# Altium schematic sheet AUDIO.SchDoc
size A4
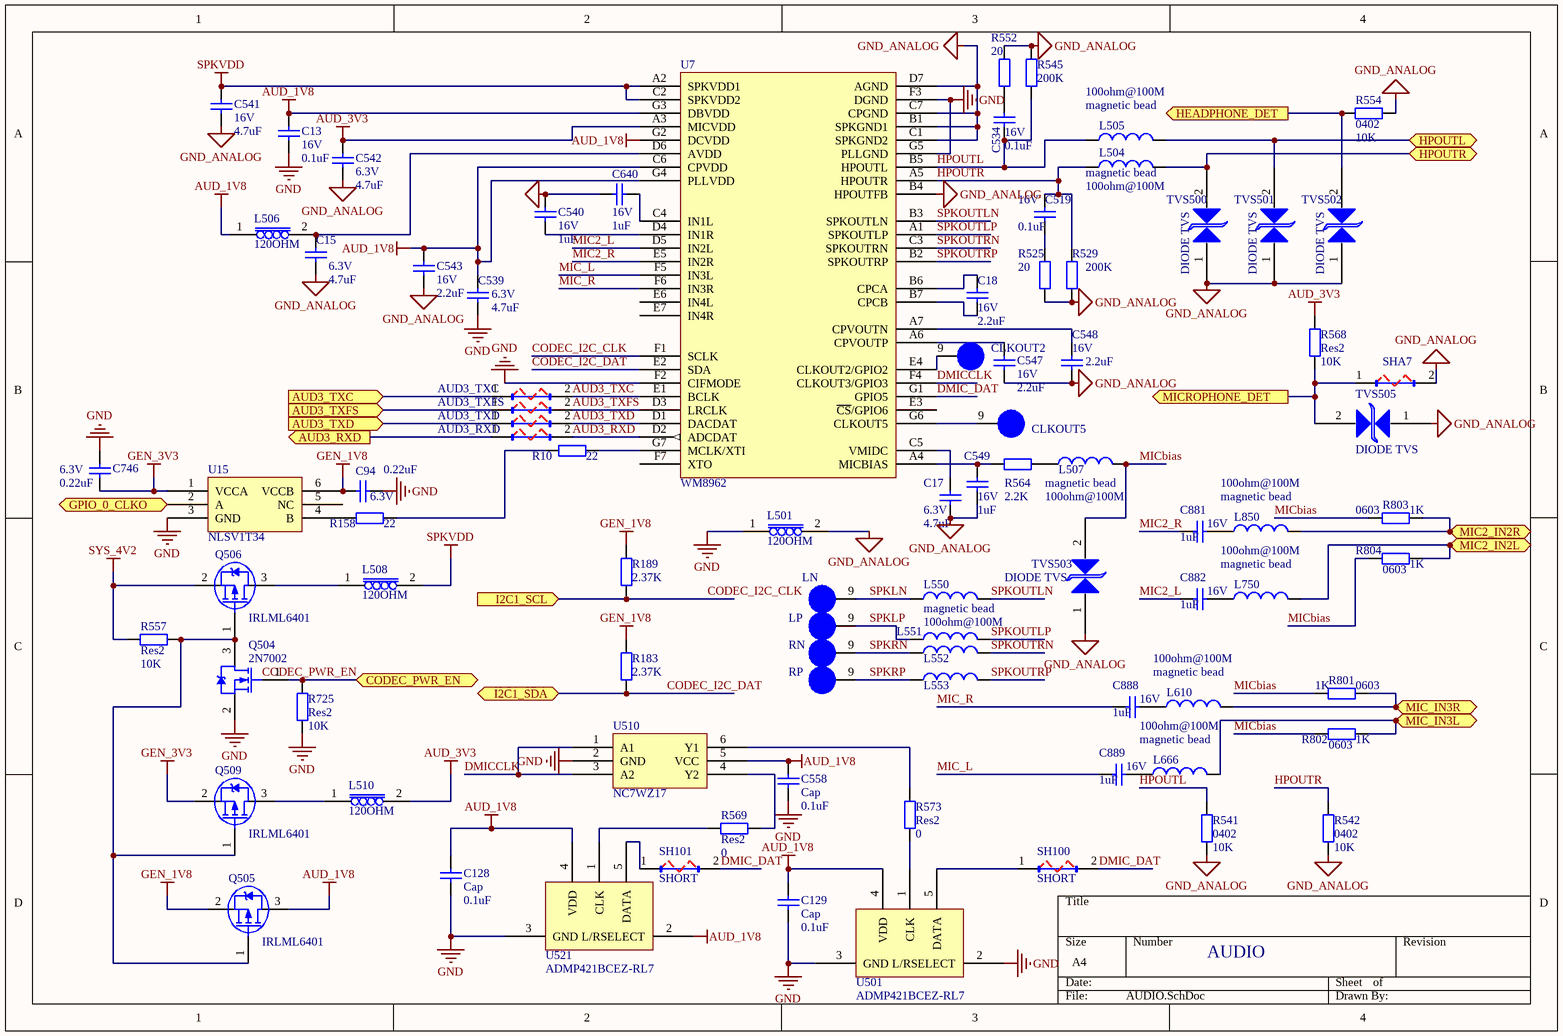
[diagram p0: AUDIO.SchDoc]

## Parts
AUD3_RXD  SHORT  [SHORT_SH]  (value not drawn)
AUD3_TXC  SHORT  [SHORT_SH]  (value not drawn)
AUD3_TXD  SHORT  [SHORT_SH]  (value not drawn)
AUD3_TXFS  SHORT  [SHORT_SH]  (value not drawn)
C13  16V  value 0.1uF  [0402]
C15  6.3V  value 4.7uF  [0603]
C17  6.3V  value 4.7uF  [0603]
C18  16V  value 2.2uF  [0603]
C94  6.3V  value 0.22uF  [0201]
C128  Cap  value 0.1uF  [0402]
C129  Cap  value 0.1uF  [0402]
C519  16V  value 0.1uF  [0402]
C534  16V  value 0.1uF  [0402]
C539  6.3V  value 4.7uF  [0603]
C540  16V  value 1uF  [0402]
C541  16V  value 4.7uF  [0603]
C542  6.3V  value 4.7uF  [0603]
C543  16V  value 2.2uF  [0603]
C547  16V  value 2.2uF  [0603]
C548  16V  value 2.2uF  [0603]
C549  16V  value 1uF  [0603]
C558  Cap  value 0.1uF  [0402]
C640  16V  value 1uF  [0402]
C746  6.3V  value 0.22uF  [0201]
C881  16V  value 1uF  [0603]
C882  16V  value 1uF  [0603]
C888  16V  value 1uF  [0603]
C889  16V  value 1uF  [0603]
CLKOUT2  TP test  [TP]  (value not drawn)
CLKOUT5  TP test  [TP]  (value not drawn)
L501  120OHM  [0603]
L504  magnetic bead  value 100ohm@100M  [0603]
L505  magnetic bead  value 100ohm@100M  [0603]
L506  120OHM  [0603]
L507  magnetic bead  value 100ohm@100M  [0603]
L508  120OHM  [0603]
L510  120OHM  [0603]
L550  magnetic bead  value 100ohm@100M  [0603]
L551  magnetic bead  [0603]  (value not drawn)
L552  magnetic bead  [0603]  (value not drawn)
L553  magnetic bead  [0603]  (value not drawn)
L610  magnetic bead  value 100ohm@100M  [0603]
L666  magnetic bead  value 100ohm@100M  [0603]
L750  magnetic bead  value 100ohm@100M  [0603]
L850  magnetic bead  value 100ohm@100M  [0603]
LN  TP test  [via]  (value not drawn)
LP  TP test  [via]  (value not drawn)
Q504  2N7002  [2N7002]
Q505  IRLML6401  [IRLML6401]
Q506  IRLML6401  [IRLML6401]
Q509  IRLML6401  [IRLML6401]
R10  22  [0603]
R158  22  [0402]
R183  value 2.37K  [0603]  (hidden comment: Res2)
R189  value 2.37K  [0603]  (hidden comment: Res2)
R525  value 20  [0603]  (hidden comment: Res2)
R529  value 200K  [0603]  (hidden comment: Res2)
R541  0402  value 10K  [0402]
R542  0402  value 10K  [0402]
R545  value 200K  [0603]  (hidden comment: Res2)
R552  value 20  [0603]  (hidden comment: Res2)
R554  0402  value 10K  [0402]
R557  Res2  value 10K  [0402]
R564  value 2.2K  [0603]  (hidden comment: Res2)
R568  Res2  value 10K  [0402]
R569  Res2  value 0  [0402]
R573  Res2  value 0  [0402]
R725  Res2  value 10K  [0402]
R801  0603  value 1K  [0603]
R802  0603  value 1K  [0603]
R803  0603  value 1K  [0603]
R804  0603  value 1K  [0603]
RN  TP test  [via]  (value not drawn)
RP  TP test  [via]  (value not drawn)
SH100  SHORT  [SHORT_SH]
SH101  SHORT  [SHORT_SH]
SHA7  SHORT  [SHORT_SH]  (value not drawn)
TVS500  DIODE TVS  [ESD9B3.3ST5G-SOD923]
TVS501  DIODE TVS  [ESD9B3.3ST5G-SOD923]
TVS502  DIODE TVS  [ESD9B3.3ST5G-SOD923]
TVS503  DIODE TVS  [ESD9B3.3ST5G-SOD923]
TVS505  DIODE TVS  [ESD9B3.3ST5G-SOD923]
U7  WM8962  [WM8962-BGA49]
U15  NLSV1T34  [NLSV1T34AM]
U501  ADMP421BCEZ-RL7  [ADMP421B-LGA_CAV]
U510  NC7WZ17  [NC7WZ17-SC70-6]
U521  ADMP421BCEZ-RL7  [ADMP421B-LGA_CAV]

## Ports
AUD3_RXD (out), AUD3_TXC (in), AUD3_TXD (in), AUD3_TXFS (in), CODEC_PWR_EN, GPIO_0_CLKO (bidir), HEADPHONE_DET (out), HPOUTL, HPOUTR, I2C1_SCL (in), I2C1_SDA (bidir), MIC2_IN2L, MIC2_IN2R, MIC_IN3L, MIC_IN3R, MICROPHONE_DET (out)

## Nets
AUD_1V8: C13.2 C128.2 C129.2 C539.2 C543.2 C558.1 L506.1(VSS3) Q505.3(D) U7.C6(CPVDD) U7.G2(DCVDD) U7.G3(DBVDD) U7.G4(PLLVDD) U501.4(VDD) U510.5(VCC) U521.2(L/RSELECT) U521.4(VDD)
AUD_3V3: C542.2 L510.2(VSS4) R568.2 U7.A3(MICVDD)
GEN_1V8: C94.1 Q505.2(S) R183.2 R189.2 U15.6(VCCB)
GEN_3V3: C746.2 Q509.2(S) U15.1(VCCA)
GND: C13.1 C94.2 C128.1 C129.1 C539.1 C558.2 C746.1 L501.1(VSS3) Q504.2(S) R725.1 U7.F2(CIFMODE) U7.F3(DGND) U7.G5(PLLGND) U15.3(GND) U501.2(L/RSELECT) U501.3(GND) U510.2(GND) U521.3(GND)
GND_ANALOG: C15.1 C17.1 C540.1 C541.1 C542.1 C543.1 C547.2 C548.2 C549.1 C640.1 L501.2(VSS4) R525.1 R529.1 R541.1 R542.1 R545.1 R552.1 R554.1 SHA7.2(VCCIO) TVS500.1(VSS6) TVS501.1(VSS6) TVS502.1(VSS6) TVS503.1(VSS6) TVS505.1(VSS6) U7.B1(SPKGND1) U7.B4(HPOUTFB) U7.C1(SPKGND2) U7.C7(CPGND) U7.D7(AGND)
SPKVDD: C541.2 L508.2(VSS4) U7.A2(SPKVDD1) U7.C2(SPKVDD2)
SYS_4V2: Q506.2(S) R557.1
AUD3_RXD: AUD3_RXD.2(VCCIO) U7.D2(ADCDAT)
AUD3_RXD: AUD3_RXD.1(VCCIO) ; port AUD3_RXD  [a separate net that carries the same name]
AUD3_TXC: AUD3_TXC.2(VCCIO) U7.E1(BCLK)
AUD3_TXC: AUD3_TXC.1(VCCIO) ; port AUD3_TXC  [a separate net that carries the same name]
AUD3_TXD: AUD3_TXD.2(VCCIO) U7.D1(DACDAT)
AUD3_TXD: AUD3_TXD.1(VCCIO) ; port AUD3_TXD  [a separate net that carries the same name]
AUD3_TXFS: AUD3_TXFS.2(VCCIO) U7.D3(LRCLK)
AUD3_TXFS: AUD3_TXFS.1(VCCIO) ; port AUD3_TXFS  [a separate net that carries the same name]
CODEC_I2C_CLK: R189.1 U7.F1(SCLK) ; port I2C1_SCL
CODEC_I2C_DAT: R183.1 U7.E2(SDA) ; port I2C1_SDA
CODEC_PWR_EN: Q504.1(G) R725.2 ; port CODEC_PWR_EN
DMIC_DAT: SH100.2(VCCIO) SH101.2(VCCIO) U7.G1(GPIO5)
DMICCLK: U7.F4(CLKOUT3/GPIO3) U510.1(A1) U510.3(A2)
GPIO_0_CLKO: U15.2(A) ; port GPIO_0_CLKO
HEADPHONE_DET: R554.2 TVS502.2(VSS5) ; port HEADPHONE_DET
HPOUTL: C534.2 L505.1 R541.2 R545.2 U7.B5(HPOUTL)
HPOUTL: L505.2 TVS501.2(VSS5) ; port HPOUTL  [a separate net that carries the same name]
HPOUTR: C519.2 L504.1 R529.2 R542.2 U7.A5(HPOUTR)
HPOUTR: L504.2 TVS500.2(VSS5) ; port HPOUTR  [a separate net that carries the same name]
MIC2_IN2L: L750.2 R804.2 ; port MIC2_IN2L
MIC2_IN2R: L850.2 R803.2 ; port MIC2_IN2R
MIC2_L: C882.2 U7.D5(IN2L)
MIC2_R: C881.2 U7.E5(IN2R)
MIC_IN3L: L666.2 R802.2 ; port MIC_IN3L
MIC_IN3R: L610.2 R801.2 ; port MIC_IN3R
MIC_L: C889.2 U7.F5(IN3L)
MIC_R: C888.2 U7.F6(IN3R)
MICbias: L507.2 R801.1 R802.1 R803.1 R804.1 TVS503.2(VSS5)
MICROPHONE_DET: R568.1 SHA7.1(VCCIO) TVS505.2(VSS5) ; port MICROPHONE_DET
SPKLN: L550.1 LN.9(S)
SPKLP: L551.1 LP.9(S)
SPKOUTLN: L550.2 U7.B3(SPKOUTLN)
SPKOUTLP: L551.2 U7.A1(SPKOUTLP)
SPKOUTRN: L552.2 U7.C3(SPKOUTRN)
SPKOUTRP: L553.2 U7.B2(SPKOUTRP)
SPKRN: L552.1 RN.9(S)
SPKRP: L553.1 RP.9(S)
NetC15_2: C15.2 L506.2(VSS4) U7.D6(AVDD)
NetC17_2: C17.2 U7.C5(VMIDC)
NetC18_1: C18.1 U7.B6(CPCA)
NetC18_2: C18.2 U7.B7(CPCB)
NetC519_1: C519.1 R525.2
NetC534_1: C534.1 R552.2
NetC540_2: C540.2 U7.D4(IN1R)
NetC547_1: C547.1 U7.A6(CPVOUTP)
NetC548_1: C548.1 U7.A7(CPVOUTN)
NetC549_2: C549.2 R564.1 U7.A4(MICBIAS)
NetC640_2: C640.2 U7.C4(IN1L)
NetC881_1: C881.1 L850.1
NetC882_1: C882.1 L750.1
NetC888_1: C888.1 L610.1
NetC889_1: C889.1 L666.1
NetCLKOUT2_9: CLKOUT2.9(S) U7.E4(CLKOUT2/GPIO2)
NetCLKOUT5_9: CLKOUT5.9(S) U7.G6(CLKOUT5)
NetL507_1: L507.1 R564.2
NetL508_1: L508.1(VSS3) Q506.3(D)
NetL510_1: L510.1(VSS3) Q509.3(D)
NetQ504_3: Q504.3(D) Q505.1(G) Q506.1(G) Q509.1(G) R557.2
NetR10_1: R10.1 R158.2
NetR10_2: R10.2 U7.G7(MCLK/XTI)
NetR158_1: R158.1 U15.4(B)
NetR569_1: R569.1 U521.1(CLK)
NetR569_2: R569.2 U510.4(Y2)
NetR573_1: R573.1 U501.1(CLK)
NetR573_2: R573.2 U510.6(Y1)
NetSH100_1: SH100.1(VCCIO) U501.5(DATA)
NetSH101_1: SH101.1(VCCIO) U521.5(DATA)

Not connected (* = marked no-connect by the designer): U7 E3(~{CS}/GPIO6) E6(IN4L) E7(IN4R) F7(XTO); U15 5(NC)

## Notes on the sheet
- AUDIO
- Labels drawn without touching a wire or pin: CODEC_PWR_EN

## Library data of the parts
AUD3_RXD AUD3_TXC AUD3_TXD AUD3_TXFS SH100 SH101 SHA7 = SOLDER SHORT
C13 C15 C17 C18 C94 C128 C129 C519 C534 C539-C543 C547-C549 C558 C640 C746 C881 C882 C888 C889 = Cap: Capacitor; Published: 8-Jun-2000; LatestRevisionDate: 17-Jul-2002; LatestRevisionNote: Re-released for DXP Platform.; PackageReference: RAD-0.3; Publisher: Altium Limited
L501 L506 L508 L510 = magnetic BEAD
L504 L505 L507 L550 L610 L666 L750 L850 = Inductor: Code_IEC: 1005; Published: 8-Jun-2000; LatestRevisionDate: 29-May-2009; LatestRevisionNote: IPC-7351 Footprint Added.; PackageReference: 0402-A; Publisher: Altium Limited; PackageDescription: Chip Inductor; Code_JEITA: 0402
L551-L553 = Inductor: Code_IEC: 1005; Value: 100ohm@100M; Published: 8-Jun-2000; LatestRevisionDate: 29-May-2009; LatestRevisionNote: IPC-7351 Footprint Added.; PackageReference: 0402-A; Publisher: Altium Limited; PackageDescription: Chip Inductor; Code_JEITA: 0402
R10 R183 R189 R525 R529 R541 R542 R545 R552 R554 R557 R564 R568 R569 R573 R725 R801-R804 = Res2: Resistor; Published: 8-Jun-2000; LatestRevisionDate: 17-Jul-2002; LatestRevisionNote: Re-released for DXP Platform.; PackageReference: AXIAL-0.4; Publisher: Altium Limited
  R10: Value: 22
R158 = Res2: Resistor; Value: 33; Published: 8-Jun-2000; LatestRevisionDate: 17-Jul-2002; LatestRevisionNote: Re-released for DXP Platform.; PackageReference: AXIAL-0.4; Publisher: Altium Limited
U501 U521 = ADMP421B